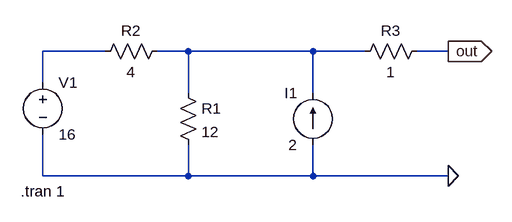
[diagram p0: schematic Draft27.asc]
Draft27.asc, the LTspice schematic file:
Version 4
SHEET 1 880 680
WIRE 96 96 0 96
WIRE 224 96 176 96
WIRE 416 96 224 96
WIRE 496 96 416 96
WIRE 624 96 576 96
WIRE 0 144 0 96
WIRE 224 160 224 96
WIRE 416 160 416 96
WIRE 0 288 0 224
WIRE 224 288 224 240
WIRE 224 288 0 288
WIRE 416 288 416 240
WIRE 416 288 224 288
WIRE 624 288 416 288
FLAG 624 288 0
FLAG 624 96 out
IOPIN 624 96 Out
SYMBOL res 208 144 R0
SYMATTR InstName R1
SYMATTR Value 12
SYMBOL res 192 80 R90
WINDOW 0 0 56 VBottom 2
WINDOW 3 32 56 VTop 2
SYMATTR InstName R2
SYMATTR Value 4
SYMBOL res 592 80 R90
WINDOW 0 0 56 VBottom 2
WINDOW 3 32 56 VTop 2
SYMATTR InstName R3
SYMATTR Value 1
SYMBOL current 416 240 R180
WINDOW 0 24 80 Left 2
WINDOW 3 24 0 Left 2
WINDOW 123 0 0 Left 0
WINDOW 39 0 0 Left 0
SYMATTR InstName I1
SYMATTR Value 2
SYMBOL voltage 0 128 R0
WINDOW 123 0 0 Left 0
WINDOW 39 0 0 Left 0
SYMATTR InstName V1
SYMATTR Value 16
TEXT -34 312 Left 2 !.tran 1

The netlist it stands for:
* Draft27.asc
R1 N002 0 12
R2 N002 N001 4
R3 out N002 1
I1 0 N002 2
V1 N001 0 16
.tran 1
.backanno
.end